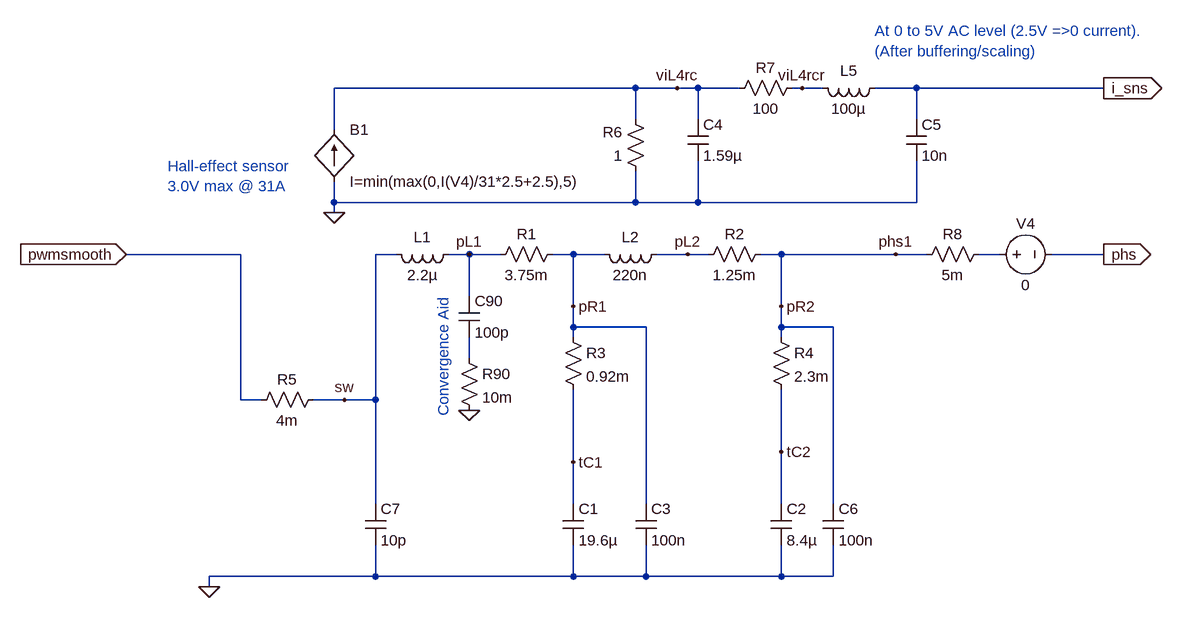
[diagram p0: schematic USA13030_X1_NG_cont_out_fltr.asc]
USA13030_X1_NG_cont_out_fltr.asc, the LTspice schematic file:
Version 4
SHEET 1 1092 680
WIRE 224 -336 -240 -336
WIRE 288 -336 224 -336
WIRE 320 -336 288 -336
WIRE 384 -336 320 -336
WIRE 480 -336 464 -336
WIRE 512 -336 480 -336
WIRE 656 -336 592 -336
WIRE 944 -336 656 -336
WIRE 224 -288 224 -336
WIRE 320 -288 320 -336
WIRE 656 -288 656 -336
WIRE -240 -272 -240 -336
WIRE -240 -160 -240 -192
WIRE 224 -160 224 -208
WIRE 224 -160 -240 -160
WIRE 320 -160 320 -224
WIRE 320 -160 224 -160
WIRE 656 -160 656 -224
WIRE 656 -160 320 -160
WIRE -240 -144 -240 -160
WIRE -384 -80 -560 -80
WIRE -144 -80 -176 -80
WIRE -32 -80 -64 -80
WIRE 16 -80 -32 -80
WIRE 128 -80 96 -80
WIRE 176 -80 128 -80
WIRE 304 -80 256 -80
WIRE 336 -80 304 -80
WIRE 448 -80 416 -80
WIRE 624 -80 448 -80
WIRE 672 -80 624 -80
WIRE 784 -80 752 -80
WIRE 944 -80 864 -80
WIRE -32 -16 -32 -80
WIRE 128 0 128 -80
WIRE 448 0 448 -80
WIRE 128 32 128 0
WIRE 240 32 128 32
WIRE 448 32 448 0
WIRE 528 32 448 32
WIRE 128 48 128 32
WIRE 448 48 448 32
WIRE -32 80 -32 48
WIRE -384 144 -384 -80
WIRE -352 144 -384 144
WIRE -224 144 -272 144
WIRE -176 144 -176 -80
WIRE -176 144 -224 144
WIRE 448 224 448 128
WIRE 128 240 128 128
WIRE -176 304 -176 144
WIRE 128 304 128 240
WIRE 240 304 240 32
WIRE 448 304 448 224
WIRE 528 304 528 32
WIRE -176 416 -176 368
WIRE -176 416 -432 416
WIRE 128 416 128 368
WIRE 128 416 -176 416
WIRE 240 416 240 368
WIRE 240 416 128 416
WIRE 448 416 448 368
WIRE 448 416 240 416
WIRE 528 416 528 368
WIRE 528 416 448 416
WIRE -432 432 -432 416
FLAG -432 432 0
FLAG -560 -80 pwmsmooth
IOPIN -560 -80 In
FLAG 944 -80 phs
IOPIN 944 -80 Out
FLAG -224 144 sw
FLAG -32 -80 pL1
FLAG 128 0 pR1
FLAG 128 240 tC1
FLAG 448 224 tC2
FLAG 448 0 pR2
FLAG 304 -80 pL2
FLAG -240 -144 0
FLAG 288 -336 viL4rc
FLAG 480 -336 viL4rcr
FLAG 944 -336 i_sns
IOPIN 944 -336 Out
FLAG 624 -80 phs1
FLAG -32 160 0
SYMBOL ind -48 -96 R90
WINDOW 0 5 56 VBottom 2
WINDOW 3 32 56 VTop 2
WINDOW 39 60 56 VTop 2
SYMATTR InstName L1
SYMATTR Value 2.2µ
SYMBOL ind 272 -96 R90
WINDOW 0 5 56 VBottom 2
WINDOW 3 32 56 VTop 2
WINDOW 39 60 56 VTop 2
SYMATTR InstName L2
SYMATTR Value 220n
SYMBOL cap 112 304 R0
WINDOW 39 24 36 Left 2
SYMATTR InstName C1
SYMATTR Value 19.6µ
SYMBOL cap 432 304 R0
WINDOW 39 24 36 Left 2
SYMATTR InstName C2
SYMATTR Value 8.4µ
SYMBOL res 112 -96 R90
WINDOW 0 0 56 VBottom 2
WINDOW 3 32 56 VTop 2
SYMATTR InstName R1
SYMATTR Value 3.75m
SYMBOL res 432 -96 R90
WINDOW 0 0 56 VBottom 2
WINDOW 3 32 56 VTop 2
SYMATTR InstName R2
SYMATTR Value 1.25m
SYMBOL res 112 32 R0
SYMATTR InstName R3
SYMATTR Value 0.92m
SYMBOL res 432 32 R0
SYMATTR InstName R4
SYMATTR Value 2.3m
SYMBOL res 240 -192 R180
WINDOW 0 36 76 Left 2
WINDOW 3 36 40 Left 2
SYMATTR InstName R6
SYMATTR Value 1
SYMBOL cap 304 -288 R0
SYMATTR InstName C4
SYMATTR Value 1.59µ
SYMBOL res 480 -352 R90
WINDOW 0 0 56 VBottom 2
WINDOW 3 32 56 VTop 2
SYMATTR InstName R7
SYMATTR Value 100
SYMBOL ind 608 -352 R90
WINDOW 0 5 56 VBottom 2
WINDOW 3 32 56 VTop 2
WINDOW 39 60 56 VTop 2
SYMATTR InstName L5
SYMATTR Value 100µ
SYMBOL cap 640 -288 R0
SYMATTR InstName C5
SYMATTR Value 10n
SYMBOL res -256 128 R90
WINDOW 0 0 56 VBottom 2
WINDOW 3 32 56 VTop 2
SYMATTR InstName R5
SYMATTR Value 4m
SYMBOL bi -240 -192 M180
WINDOW 0 24 80 Left 2
WINDOW 3 24 0 Left 2
SYMATTR InstName B1
SYMATTR Value I=min(max(0,I(V4)/31*2.5+2.5),5)
SYMBOL voltage 768 -80 R270
WINDOW 0 32 56 VTop 2
WINDOW 3 -32 56 VBottom 2
WINDOW 123 0 0 Left 2
WINDOW 39 0 0 Left 2
SYMATTR InstName V4
SYMATTR Value 0
SYMBOL cap 224 304 R0
WINDOW 39 24 36 Left 2
SYMATTR InstName C3
SYMATTR Value 100n
SYMBOL cap 512 304 R0
WINDOW 39 24 36 Left 2
SYMATTR InstName C6
SYMATTR Value 100n
SYMBOL cap -192 304 R0
WINDOW 39 24 36 Left 2
SYMATTR InstName C7
SYMATTR Value 10p
SYMBOL res 768 -96 R90
WINDOW 0 0 56 VBottom 2
WINDOW 3 32 56 VTop 2
SYMATTR InstName R8
SYMATTR Value 5m
SYMBOL cap -48 -16 R0
SYMATTR InstName C90
SYMATTR Value 100p
SYMBOL res -48 64 R0
SYMATTR InstName R90
SYMATTR Value 10m
TEXT 592 -424 Left 2 ;At 0 to 5V AC level (2.5V =>0 current).\n(After buffering/scaling)
TEXT -496 -216 Left 2 ;Hall-effect sensor\n3.0V max @ 31A
TEXT -72 -16 VRight 2 ;Convergence Aid

The netlist it stands for:
* USA13030_X1_NG_cont_out_fltr.asc
L1 pL1 sw 2.2µ
L2 pL2 pR1 220n
C1 tC1 0 19.6µ
C2 tC2 0 8.4µ
R1 pR1 pL1 3.75m
R2 phs1 pL2 1.25m
R3 pR1 tC1 0.92m
R4 phs1 tC2 2.3m
R6 0 viL4rc 1
C4 viL4rc 0 1.59µ
R7 viL4rcr viL4rc 100
L5 i_sns viL4rcr 100µ
C5 i_sns 0 10n
R5 sw pwmsmooth 4m
B1 0 viL4rc I=min(max(0,I(V4)/31*2.5+2.5),5)
V4 N001 phs 0
C3 pR1 0 100n
C6 phs1 0 100n
C7 sw 0 10p
R8 N001 phs1 5m
C90 pL1 N002 100p
R90 N002 0 10m
* At 0 to 5V AC level (2.5V =>0 current).
* (After buffering/scaling)
* Hall-effect sensor
* 3.0V max @ 31A
* Convergence Aid
.backanno
.end